# EAGLE schematic 3400 (EAGLE 9.6.2)
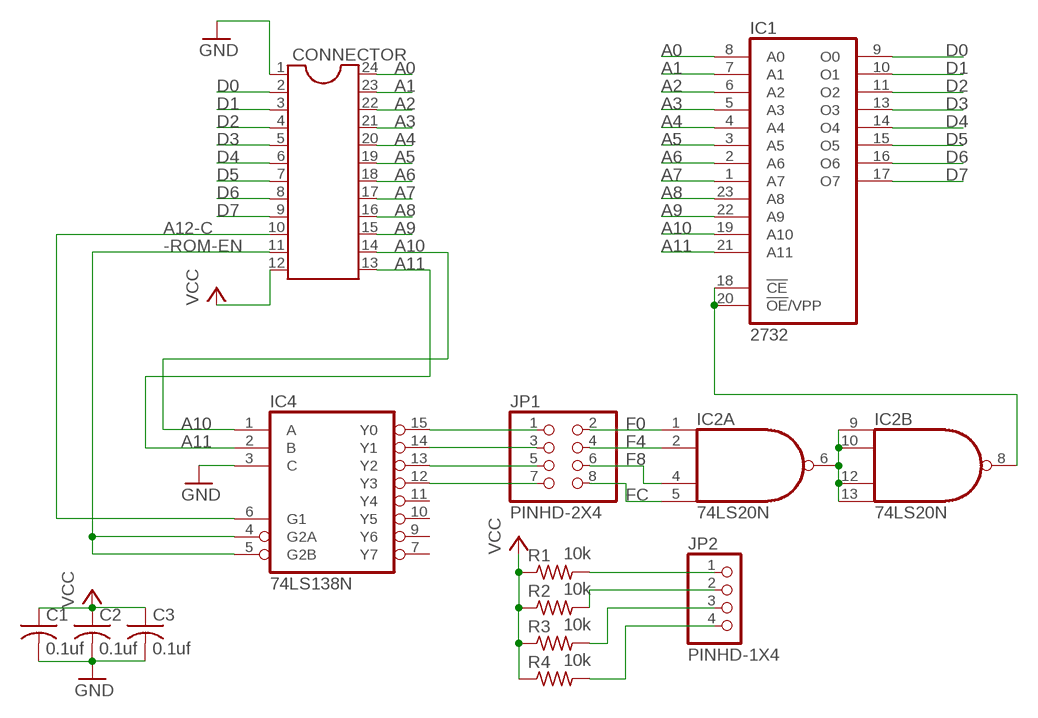
[diagram p0: schematic, sheet 1]

## Parts
C1  0.1uf  C-US025-024X044  [C025-024X044]
C2  0.1uf  C-US025-024X044  [C025-024X044]
C3  0.1uf  C-US025-024X044  [C025-024X044]
CONNECTOR  DIL24-6  [DIL24-6]
IC1  2732  [DIL24]
IC2  74LS20N  [DIL14]
IC4  74LS138N  [DIL16]
JP1  PINHD-2X4  [2X04]
JP2  PINHD-1X4  [1X04]
R1  10k  R-US_0207/10  [0207/10]
R2  10k  R-US_0207/10  [0207/10]
R3  10k  R-US_0207/10  [0207/10]
R4  10k  R-US_0207/10  [0207/10]

## Nets
-ROM-EN: CONNECTOR.11 IC4.4(G2A) IC4.5(G2B)
A0: CONNECTOR.24 IC1.8(A0)
A1: CONNECTOR.23 IC1.7(A1)
A2: CONNECTOR.22 IC1.6(A2)
A3: CONNECTOR.21 IC1.5(A3)
A4: CONNECTOR.20 IC1.4(A4)
A5: CONNECTOR.19 IC1.3(A5)
A6: CONNECTOR.18 IC1.2(A6)
A7: CONNECTOR.17 IC1.1(A7)
A8: CONNECTOR.16 IC1.23(A8)
A9: CONNECTOR.15 IC1.22(A9)
A10: CONNECTOR.14 IC1.19(A10) IC4.1(A)
A11: CONNECTOR.13 IC1.21(A11) IC4.2(B)
A12-C: CONNECTOR.10 IC4.6(G1)
D0: CONNECTOR.2 IC1.9(O0)
D1: CONNECTOR.3 IC1.10(O1)
D2: CONNECTOR.4 IC1.11(O2)
D3: CONNECTOR.5 IC1.13(O3)
D4: CONNECTOR.6 IC1.14(O4)
D5: CONNECTOR.7 IC1.15(O5)
D6: CONNECTOR.8 IC1.16(O6)
D7: CONNECTOR.9 IC1.17(O7)
F0: IC2.1(A:I0) JP1.2
F4: IC2.2(A:I1) JP1.4
F8: IC2.4(A:I2) JP1.6
FC: IC2.5(A:I3) JP1.8
GND: C1.2 C2.2 C3.2 CONNECTOR.1 IC4.3(C)
N$1: IC1.18(!CE) IC1.20(!OE!/VPP) IC2.8(B:O)
N$2: IC4.15(Y0) JP1.1
N$3: IC2.6(A:O) IC2.9(B:I0) IC2.10(B:I1) IC2.12(B:I2) IC2.13(B:I3)
N$4: IC4.14(Y1) JP1.3
N$5: IC4.13(Y2) JP1.5
N$6: IC4.12(Y3) JP1.7
N$11: JP2.1 R1.2
N$12: JP2.2 R2.2
N$13: JP2.3 R3.2
N$14: JP2.4 R4.2
VCC: C1.1 C2.1 C3.1 CONNECTOR.12 R1.1 R2.1 R3.1 R4.1
Unconnected: IC4.7(Y7) IC4.9(Y6) IC4.10(Y5) IC4.11(Y4)

## Power pins joined to a net without a drawn wire
GND: IC1.12(GND) IC2.7(P:GND) IC4.8(GND)
VCC: IC1.24(VCC) IC2.14(P:VCC) IC4.16(VCC)

## Library data of the parts
C1-C3 = rcl:C-US: CAPACITOR, American symbol; SPICEPREFIX: C
CONNECTOR = ic-package:DIL24: Dual In Line
IC1 = memory:2732: MEMORY
IC2 = 74xx-us:74*20: Dual 4-input NAND gate
IC4 = 74xx-us:74*138: 3-line to 8-line DECODER/DEMULTIPLEXER
JP1 = Connector:PINHD-2X4: PIN HEADER; CATEGORY: CONNECTOR; SUB-CATEGORY: PIN-HEADER
JP2 = Connector:PINHD-1X4: PIN HEADER; CATEGORY: CONNECTOR; SUB-CATEGORY: PIN-HEADER
R1-R4 = rcl:R-US_: RESISTOR, American symbol; SPICEPREFIX: R